# EAGLE schematic pico v2 (EAGLE 9.6.2)
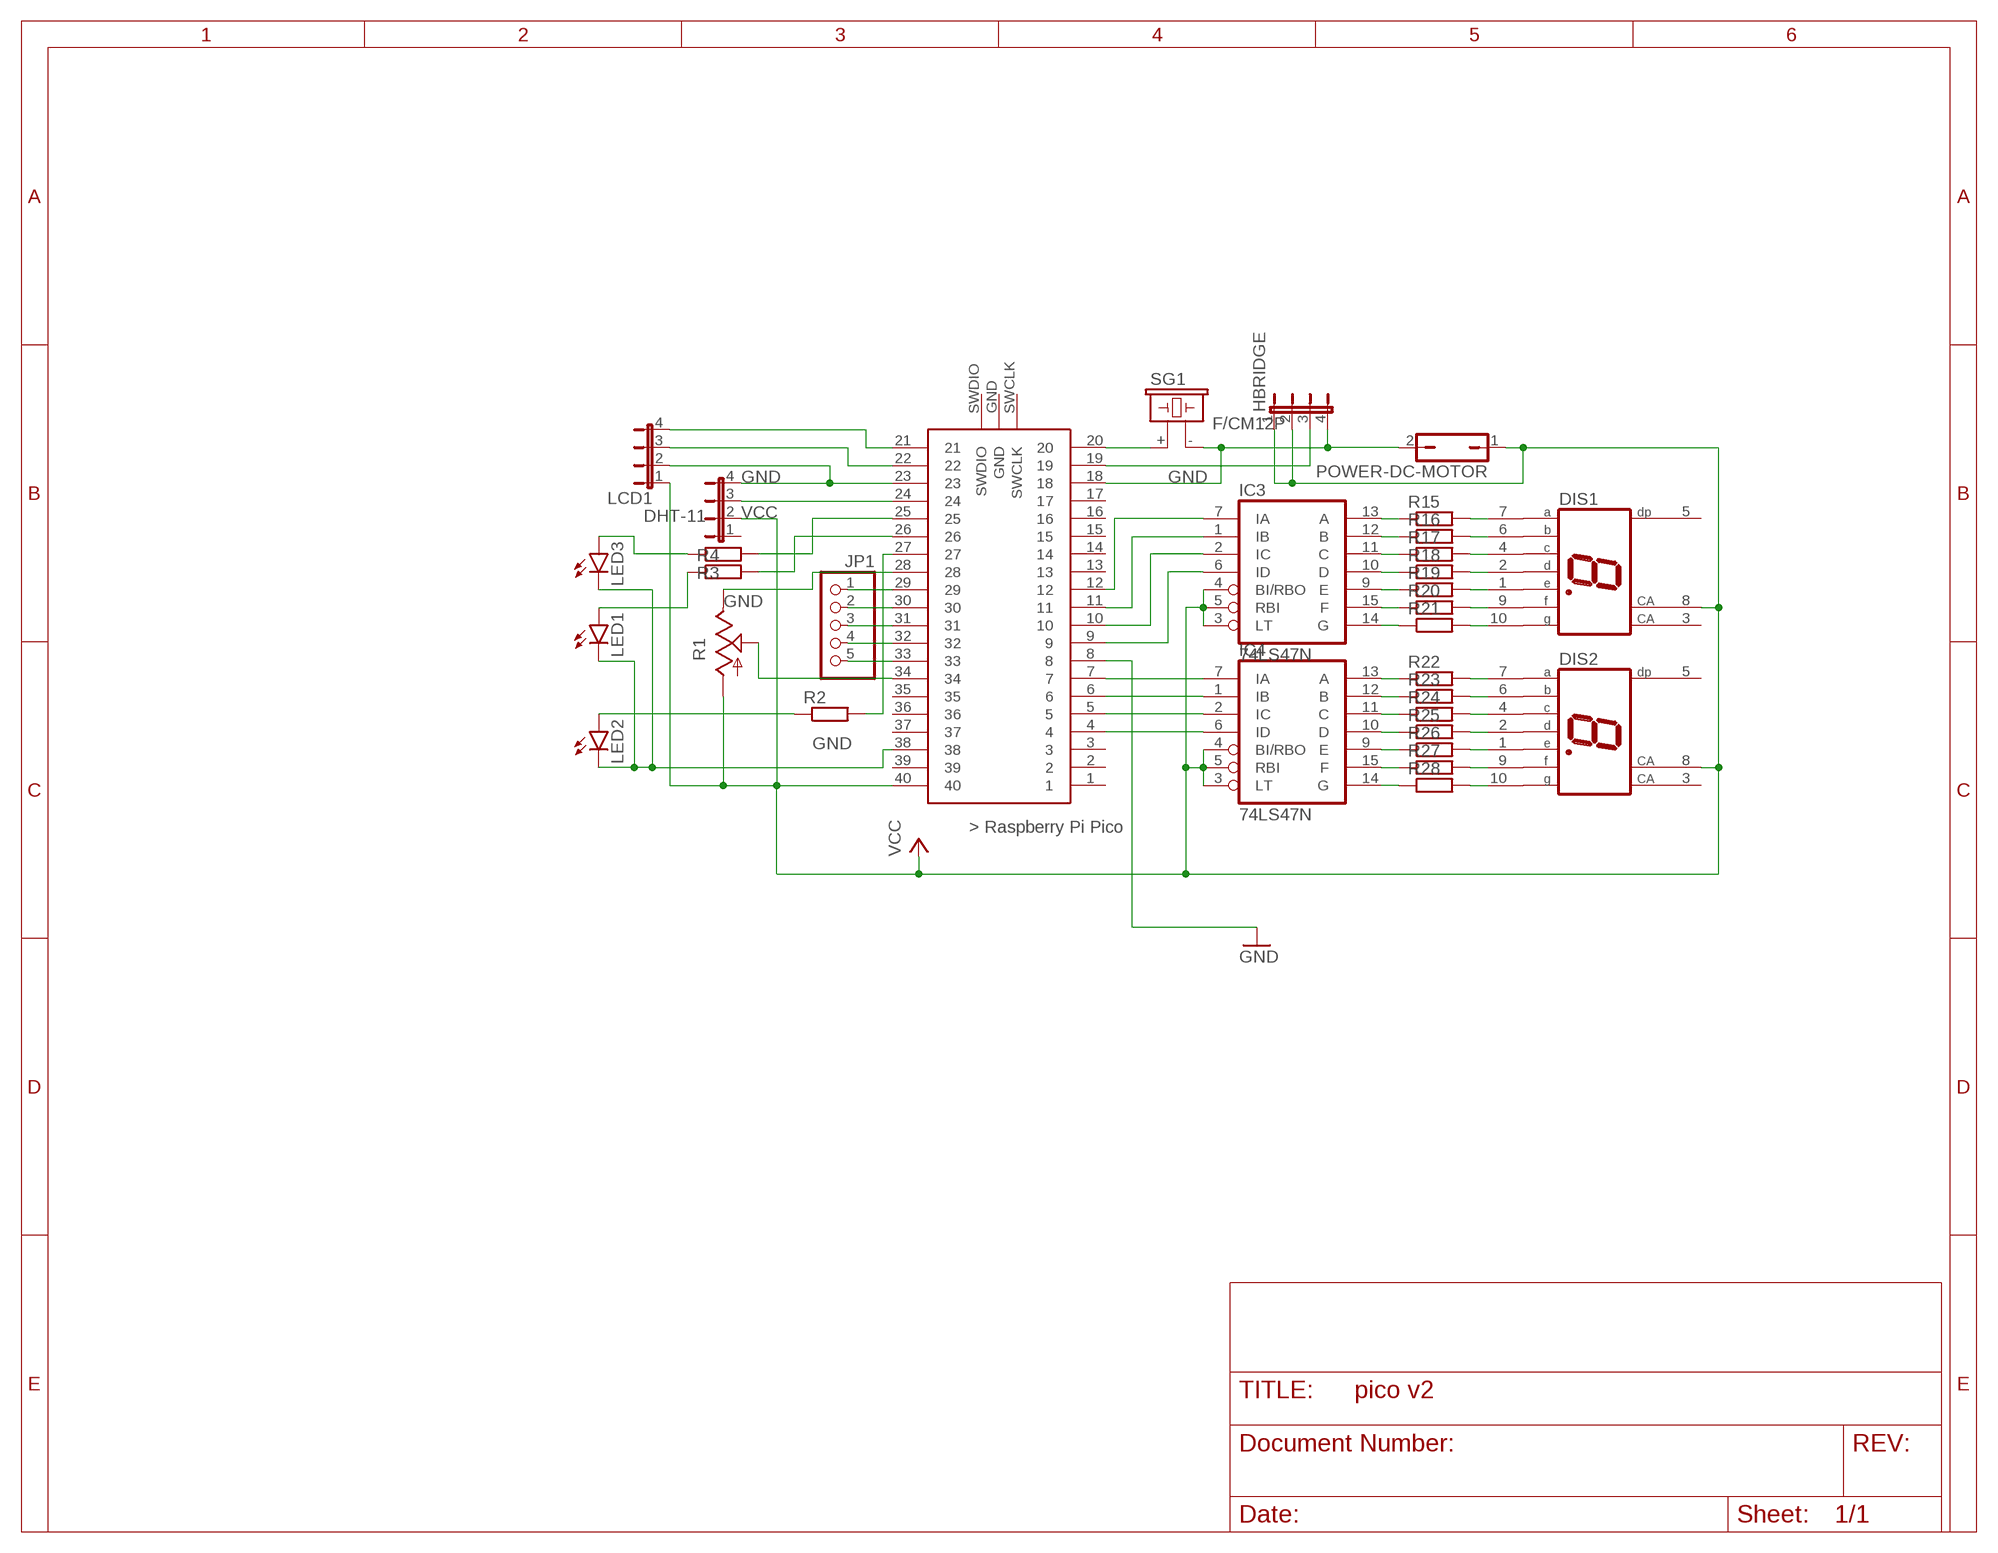
[diagram p0: schematic, sheet 1]

## Parts
DHT-11  JP4E  [JP4]
DIS1  HD-H101  [HDSP-M]
DIS2  HD-H101  [HDSP-M]
HBRIDGE  JP4E  [JP4]
IC3  74LS47N  [DIL16]
IC4  74LS47N  [DIL16]
JP1  PINHD-1X5  [1X05]
LCD1  JP4E  [JP4]
LED1  LED5MM  [LED5MM]
LED2  LED5MM  [LED5MM]
LED3  LED5MM  [LED5MM]
POWER-DC-MOTOR  JP1Q  [JP1]
R1  TRIM_US-CA6V  [CA6V]
R2  R-EU_0207/10  [0207/10]
R3  R-EU_0207/10  [0207/10]
R4  R-EU_0207/10  [0207/10]
R15  R-EU_0207/12  [0207/12]
R16  R-EU_0207/12  [0207/12]
R17  R-EU_0207/12  [0207/12]
R18  R-EU_0207/12  [0207/12]
R19  R-EU_0207/12  [0207/12]
R20  R-EU_0207/12  [0207/12]
R21  R-EU_0207/12  [0207/12]
R22  R-EU_0207/12  [0207/12]
R23  R-EU_0207/12  [0207/12]
R24  R-EU_0207/12  [0207/12]
R25  R-EU_0207/12  [0207/12]
R26  R-EU_0207/12  [0207/12]
R27  R-EU_0207/12  [0207/12]
R28  R-EU_0207/12  [0207/12]
SG1  F/CM12P  [F/CM12P]
U$1  RASPBERRY-PI-PICO_TH  [FT_RASPBERRY-PI-PICO_TH]

## Nets
GND: DHT-11.4 HBRIDGE.4 LCD1.2 LED1.K(C) LED2.K(C) LED3.K(C) POWER-DC-MOTOR.2 R1.E SG1.- U$1.8 U$1.18 U$1.23 U$1.28 U$1.38
N$1: IC4.7(IA) U$1.7
N$2: IC4.1(IB) U$1.6
N$3: IC4.2(IC) U$1.5
N$4: IC4.6(ID) U$1.4
N$5: R1.S U$1.34
N$6: IC3.14(G) R21.1
N$7: DIS2.7(A) R22.2
N$8: DIS2.6(B) R23.2
N$9: DIS2.4(C) R24.2
N$10: DIS2.2(D) R25.2
N$11: DIS2.1(E) R26.2
N$12: DIS1.10(G) R21.2
N$13: LED1.A R3.1
N$14: IC3.6(ID) U$1.9
N$15: IC3.2(IC) U$1.10
N$16: IC3.1(IB) U$1.11
N$17: IC3.7(IA) U$1.12
N$18: DIS2.9(F) R27.2
N$19: DIS2.10(G) R28.2
N$20: IC4.13(A) R22.1
N$21: IC4.12(B) R23.1
N$22: IC4.11(C) R24.1
N$23: DIS1.7(A) R15.2
N$24: DIS1.6(B) R16.2
N$25: DIS1.4(C) R17.2
N$26: DIS1.2(D) R18.2
N$27: DIS1.1(E) R19.2
N$28: JP1.1 U$1.29
N$29: JP1.2 U$1.30
N$30: IC4.10(D) R25.1
N$31: IC4.9(E) R26.1
N$32: IC4.15(F) R27.1
N$33: IC4.14(G) R28.1
N$34: SG1.+ U$1.20
N$35: JP1.3 U$1.31
N$36: DIS1.9(F) R20.2
N$37: IC3.13(A) R15.1
N$38: IC3.12(B) R16.1
N$39: IC3.11(C) R17.1
N$40: IC3.10(D) R18.1
N$41: IC3.9(E) R19.1
N$42: IC3.15(F) R20.1
N$43: HBRIDGE.3 U$1.19
N$44: JP1.4 U$1.32
N$45: DHT-11.3 U$1.24
N$46: LCD1.4 U$1.21
N$47: LCD1.3 U$1.22
N$48: JP1.5 U$1.33
N$51: R2.2 U$1.27
N$52: R4.2 U$1.25
N$53: R3.2 U$1.26
N$54: LED2.A R2.1
N$56: LED3.A R4.1
VCC: DHT-11.2 DIS1.8(CA) DIS2.8(CA) HBRIDGE.1 HBRIDGE.2 IC3.3(LT) IC3.4(BI/RBO) IC3.5(RBI) IC4.3(LT) IC4.4(BI/RBO) IC4.5(RBI) LCD1.1 POWER-DC-MOTOR.1 R1.A U$1.40
Unconnected: DHT-11.1 DIS1.3(CA) DIS1.5(DP) DIS2.3(CA) DIS2.5(DP) U$1.1 U$1.2 U$1.3 U$1.13 U$1.14 U$1.15 U$1.16 U$1.17 U$1.35 U$1.36 U$1.37 U$1.39 U$1.GND U$1.SWCLK U$1.SWDIO

## Power pins joined to a net without a drawn wire
GND: IC3.8(GND) IC4.8(GND)
VCC: IC3.16(VCC) IC4.16(VCC)

## Library data of the parts
DHT-11 HBRIDGE LCD1 = jumper:JP4E: JUMPER
DIS1 DIS2 = display-hp:HD-H101: LED DISPLAY 1-character 7 segment, decimal point right; OC_FARNELL: unknown; OC_NEWARK: unknown
IC3 IC4 = 74xx-eu:74*47: BCD to seven segment DECODER/DRIVER Source: http://www.ee.washington.edu/stores/DataSheets/74ls/74ls47.pdf
JP1 = pinhead:PINHD-1X5: PIN HEADER
LED1-LED3 = led:LED: LED OSRAM: - CHIPLED LG R971, LG N971, LY N971, LG Q971, LY Q971, LO R971, LY R971 LH N974, LH R974 LS Q976, LO Q976, LY Q976 LO Q996 - Hyper CHIPLED LW Q18S LB Q993, LB Q99A, LB R99A - SideLED LS A670, LO A670, LY A670, LG A670, LP A670 LB A673, LV A673, LT A673, LW A673 LH A674 LY A675 LS A676, LA A676, LO A676, LY A676, LW A676 LS A679, LY A679, LG A679 - Hyper Micro SIDELED® LS Y876, LA Y876, LO Y876, LY Y876 LT Y87S - SmartLED LW L88C, LW L88S LB L89C, LB L89S, LG L890 LS L89K, LO L89K, LY L89K LS L896, LA L896, LO L896, LY L896 - TOPLED LS T670, LO T670, LY T670, LG T670, LP T670 LSG T670, LSP T670, LSY T670, LOP T670, LYG T670 LG T671, LOG T671, LSG T671 LB T673, LV T673, LT T673, LW T673 LH T674 LS T676, LA T676, LO T676, LY T676, LB T676, LH T676, LSB T676, LW T676 LB T67C, LV T67C, LT T67C, LS T67K, LO T67K, LY T67K, LW E67C LS E67B, LA E67B, LO E67B, LY E67B, LB E67C, LV E67C, LT E67C LW T67C LS T679, LY T679, LG T679 LS T770, LO T770, LY T770, LG T770, LP T770 LB T773, LV T773, LT T773, LW T773 LH T774 LS E675, LA E675, LY E675, LS T675 LS T776, LA T776, LO T776, LY T776, LB T776 LHGB T686 LT T68C, LB T68C - Hyper Mini TOPLED® LB M676 - Mini TOPLED Santana® LG M470 LS M47K, LO M47K, LY M47K Source: http://www.osram.convergy.de LUXEON: - LUMILED® LXK2-PW12-R00, LXK2-PW12-S00, LXK2-PW14-U00, LXK2-PW14-V00 LXK2-PM12-R00, LXK2-PM12-S00, LXK2-PM14-U00 LXK2-PE12-Q00, LXK2-PE12-R00, LXK2-PE12-S00, LXK2-PE14-T00, LXK2-PE14-U00 LXK2-PB12-K00, LXK2-PB12-L00, LXK2-PB12-M00, LXK2-PB14-N00, LXK2-PB14-P00, LXK2-PB14-Q00 LXK2-PR12-L00, LXK2-PR12-M00, LXK2-PR14-Q00, LXK2-PR14-R00 LXK2-PD12-Q00, LXK2-PD12-R00, LXK2-PD12-S00 LXK2-PH12-R00, LXK2-PH12-S00 LXK2-PL12-P00, LXK2-PL12-Q00, LXK2-PL12-R00 Source: www.luxeon.com KINGBRIGHT: KA-3528ASYC Source: www.kingbright.com
POWER-DC-MOTOR = jumper:JP1Q: JUMPER
R1 = pot:TRIM_US-: POTENTIOMETER
R2-R4 R15-R28 = rcl:R-EU_: RESISTOR, European symbol; SPICEPREFIX: R
SG1 = buzzer:F/CM12P: BUZZER Source: Buerklin; OC_FARNELL: unknown; OC_NEWARK: unknown
U$1 = pipico:RASPBERRY-PI-PICO_TH: Raspberry Pi Pico microcontroller board for through-hole mounting.